# Altium schematic sheet ICAN-7006-MCU.SchDoc
size A3; PageSetup: Record=PageOptions|CenterHorizontal=True|CenterVertical=True|PrintScale=1.04|XCorrection=1.00|YCorrection=1.00|PrintKind=0|BorderSize=5000000|LeftOffset=0|BottomOffset=0|Orientation=2|PaperLength=1000|PaperWidth=1000|Scale=100|PaperSource=7|PrintQuality=-4|MediaType=1|DitherType=10|PaperKind=A3|PrintScaleMode=1
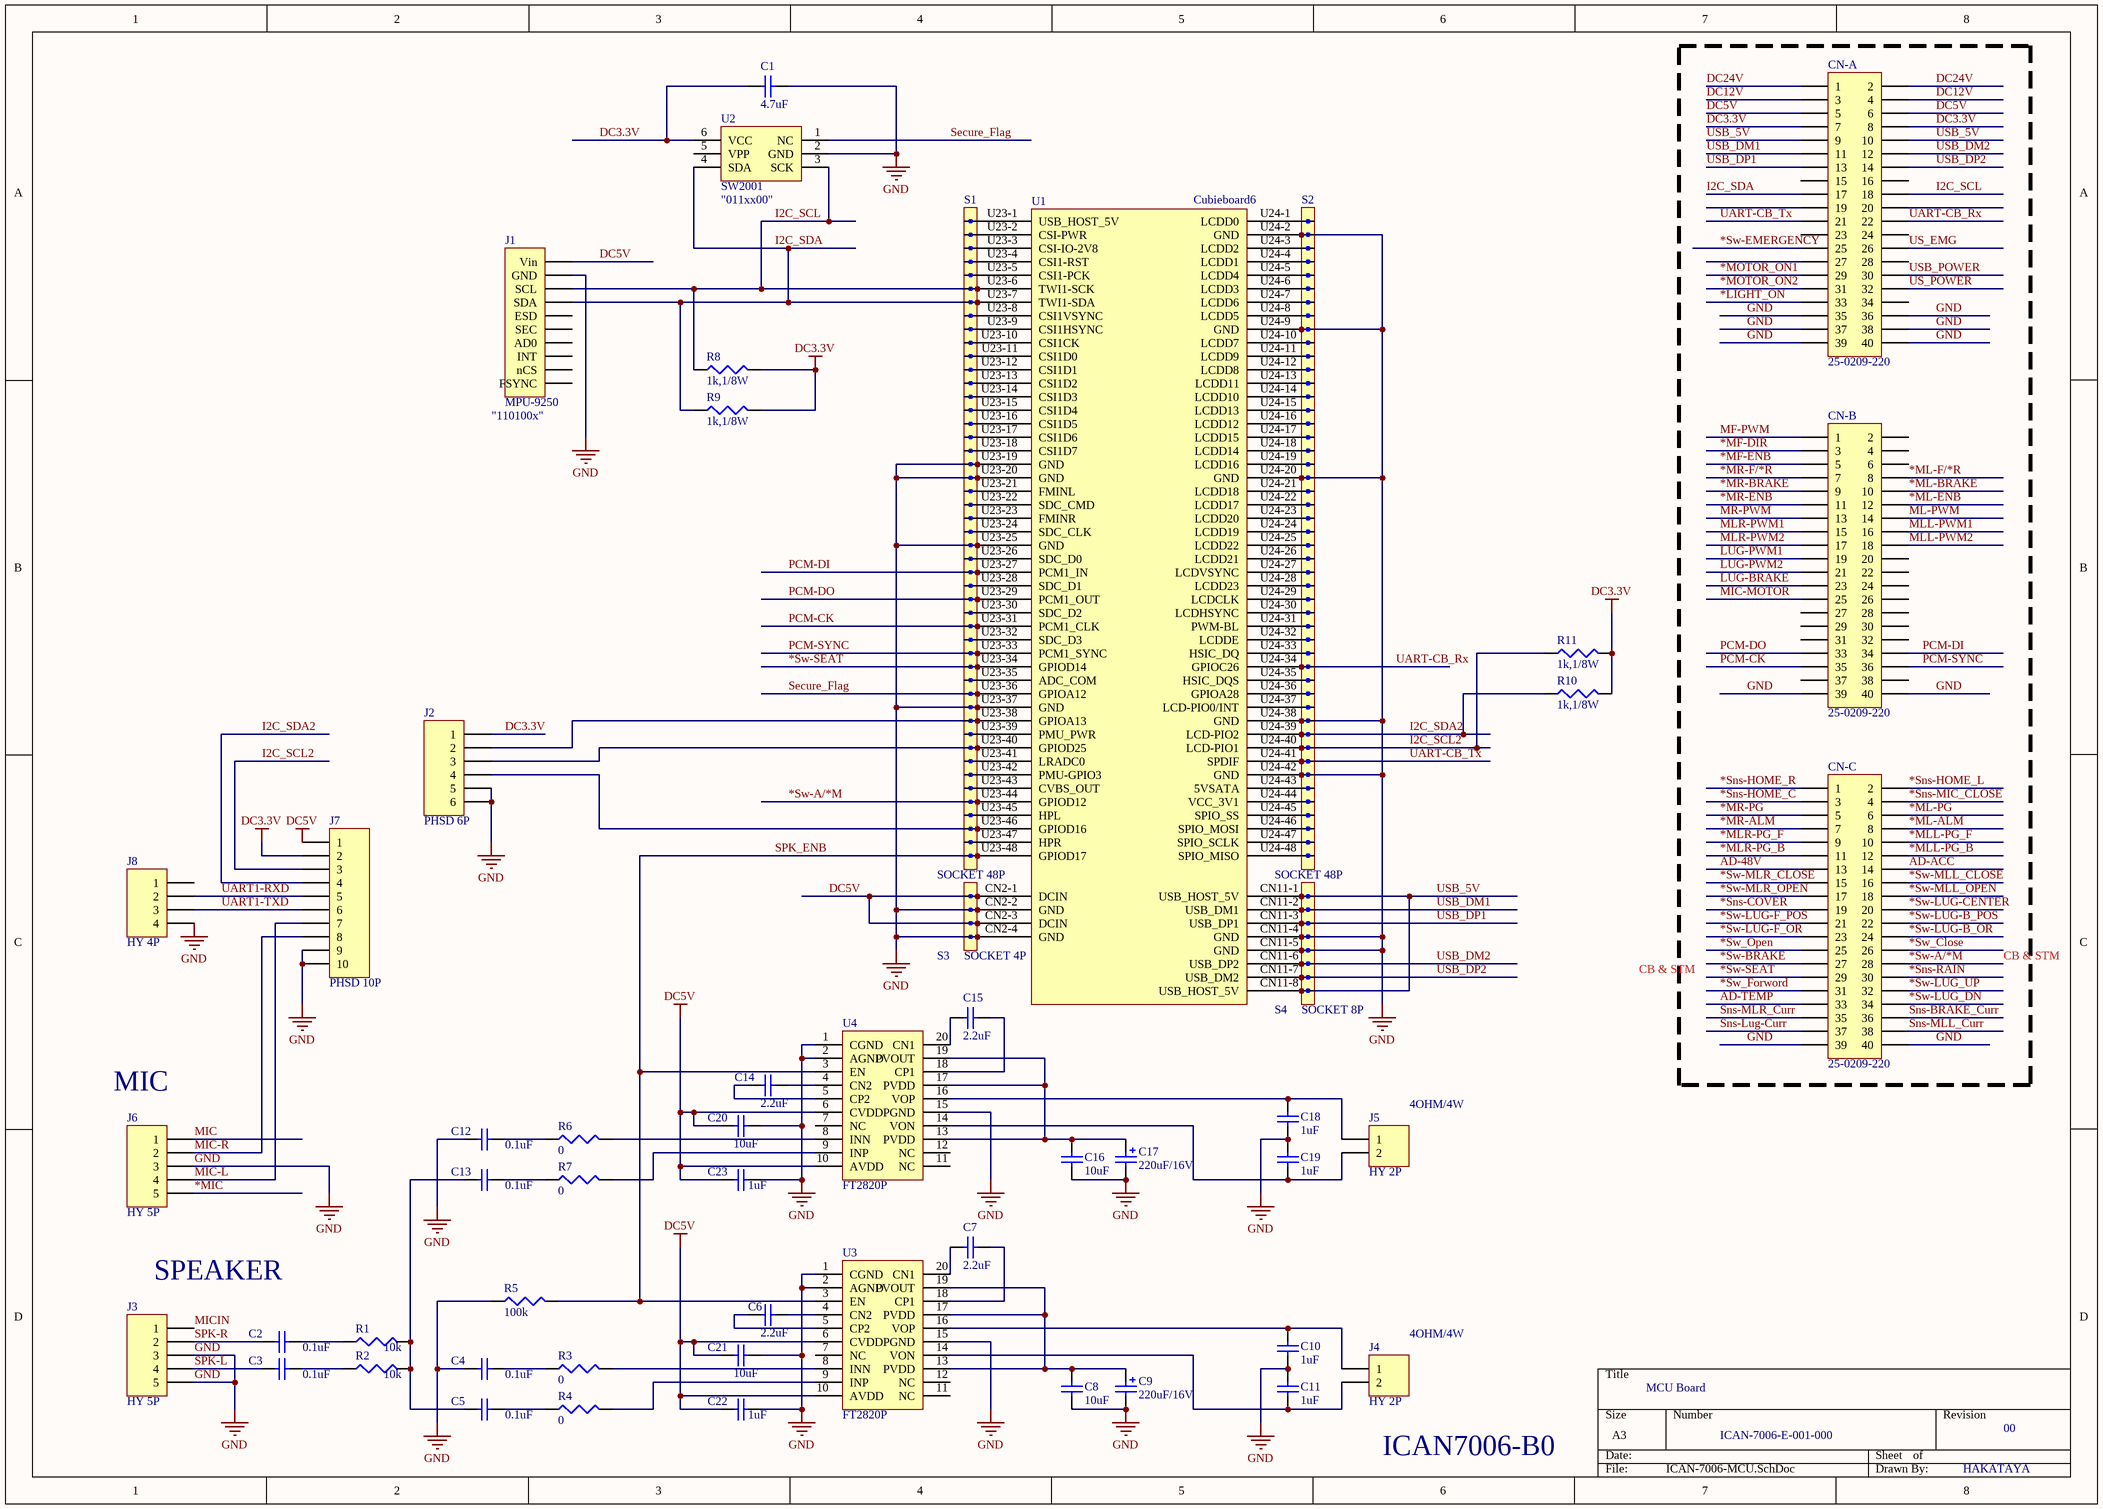
[diagram p0: ICAN-7006-MCU.SchDoc]

## Parts
C1  4.7uF  [[0805]2012]
C2  0.1uF  [[0805]2012]
C3  0.1uF  [[0805]2012]
C4  0.1uF  [[0805]2012]
C5  0.1uF  [[0805]2012]
C6  2.2uF  [[0805]2012]
C7  2.2uF  [[0805]2012]
C8  10uF  [[0805]2012]
C9  220uF/16V  [CAPA WXA PITCH 3.5mm]
C10  1uF  [[0805]2012]
C11  1uF  [[0805]2012]
C12  0.1uF  [[0805]2012]
C13  0.1uF  [[0805]2012]
C14  2.2uF  [[0805]2012]
C15  2.2uF  [[0805]2012]
C16  10uF  [[0805]2012]
C17  220uF/16V  [CAPA WXA PITCH 3.5mm]
C18  1uF  [[0805]2012]
C19  1uF  [[0805]2012]
C20  10uF  [[0805]2012]
C21  10uF  [[0805]2012]
C22  1uF  [[0805]2012]
C23  1uF  [[0805]2012]
CN-A  25-0209-220  [HDR2X20]
CN-B  25-0209-220  [HDR2X20]
CN-C  25-0209-220  [HDR2X20]
J1  MPU-9250  [HDR1X10]
J2  PHSD 6P  [PHSD WV03x2]
J3  HY 5P  [HY-5A]
J4  HY 2P  [HY-2A]
J5  HY 2P  [HY-2A]
J6  HY 5P  [HY-5A]
J7  PHSD 10P  [PHSD WV05x2]
J8  HY 4P  [HY-4AW]
R1  10k  [[0805]2012]
R2  10k  [[0805]2012]
R3  0  [[0805]2012]
R4  0  [[0805]2012]
R5  100k  [[0805]2012]
R6  0  [[0805]2012]
R7  0  [[0805]2012]
R8  1k,1/8W  [[0805]2012]
R9  1k,1/8W  [[0805]2012]
R10  1k,1/8W  [[0805]2012]
R11  1k,1/8W  [[0805]2012]
S1  SOCKET 48P  [SOCKET 2.0mm X 24 DOUBLE]
S2  SOCKET 48P  [SOCKET 2.0mm X 24 DOUBLE]
S3  SOCKET 4P  [SOCKET 2.0mm X 2 DOUBLE]
S4  SOCKET 8P  [SOCKET 2.0mm X 4 DOUBLE-2]
U1  Cubieboard6  [Cubieboard6]
U2  SW2001  [SOP]
U3  FT2820P  [SSOP-20]
U4  FT2820P  [SSOP-20]

## Blocks framed on the sheet
CB & STM: CN-A CN-B CN-C

## Nets
DC3.3V: C1.1 CN-A.7 CN-A.8 J2.1 J7.2 R8.2 R9.2 R10.2 R11.2 U2.6(VCC)
DC5V: C20.1 C21.1 C22.1 C23.1 CN-A.5 CN-A.6 J1.1(Vin) J7.1 S3.1 S3.3 U1.CN2-1(DCIN) U1.CN2-3(DCIN) U3.6(CVDD) U3.10(AVDD) U4.6(CVDD) U4.10(AVDD)
GND: C1.2 C4.1 C8.1 C9.2 C10.1 C11.2 C12.1 C16.1 C17.2 C18.1 C19.2 C20.2 C21.2 C22.2 C23.2 CN-A.35 CN-A.36 CN-A.37 CN-A.38 CN-A.39 CN-A.40 CN-B.39 CN-B.40 CN-C.39 CN-C.40 J1.2(GND) J2.5 J2.6 J3.3 J3.5 J6.3 J7.9 J7.10 J8.4 R5.2 S1.19 S1.20 S1.25 S1.37 S2.2 S2.9 S2.20 S2.38 S2.42 S3.2 S3.4 S4.4 S4.5 U1.CN2-2(GND) U1.CN2-4(GND) U1.CN11-4(GND) U1.CN11-5(GND) U1.U23-19(GND) U1.U23-20(GND) U1.U23-25(GND) U1.U23-37(GND) U1.U24-2(GND) U1.U24-9(GND) U1.U24-20(GND) U1.U24-38(GND) U1.U24-42(GND) U2.2(GND) U3.1(CGND) U3.2(AGND) U3.15(PGND) U4.1(CGND) U4.2(AGND) U4.15(PGND)
*LIGHT_ON: CN-A.33
*MF-DIR: CN-B.3
*MF-ENB: CN-B.5
*MIC: J6.5
*ML-ALM: CN-C.8
*ML-BRAKE: CN-B.10
*ML-ENB: CN-B.12
*ML-F/*R: CN-B.8
*ML-PG: CN-C.6
*MLL-PG_B: CN-C.12
*MLL-PG_F: CN-C.10
*MLR-PG_B: CN-C.11
*MLR-PG_F: CN-C.9
*MOTOR_ON1: CN-A.29
*MOTOR_ON2: CN-A.31
*MR-ALM: CN-C.7
*MR-BRAKE: CN-B.9
*MR-ENB: CN-B.11
*MR-F/*R: CN-B.7
*MR-PG: CN-C.5
*Sns-COVER: CN-C.19
*Sns-HOME_C: CN-C.3
*Sns-HOME_L: CN-C.2
*Sns-HOME_R: CN-C.1
*Sns-MIC_CLOSE: CN-C.4
*Sns-RAIN: CN-C.30
*Sw-A/*M: CN-C.28 S1.44 U1.U23-44(GPIOD12)
*Sw-BRAKE: CN-C.27
*Sw-EMERGENCY: CN-A.25
*Sw-LUG-B_OR: CN-C.24
*Sw-LUG-B_POS: CN-C.22
*Sw-LUG-CENTER: CN-C.20
*Sw-LUG-F_OR: CN-C.23
*Sw-LUG-F_POS: CN-C.21
*Sw-LUG_DN: CN-C.34
*Sw-LUG_UP: CN-C.32
*Sw-MLL_CLOSE: CN-C.16
*Sw-MLL_OPEN: CN-C.18
*Sw-MLR_CLOSE: CN-C.15
*Sw-MLR_OPEN: CN-C.17
*Sw-SEAT: CN-C.29 S1.34 U1.U23-34(GPIOD14)
*Sw_Close: CN-C.26
*Sw_Forword: CN-C.31
*Sw_Open: CN-C.25
AD-48V: CN-C.13
AD-ACC: CN-C.14
AD-TEMP: CN-C.33
DC12V: CN-A.3 CN-A.4
DC24V: CN-A.1 CN-A.2
I2C_SCL: CN-A.18 J1.3(SCL) R8.1 S1.6 U1.U23-6(TWI1-SCK) U2.3(SCK)
I2C_SCL2: J7.3 R11.1 S2.40 U1.U24-40(LCD-PIO1)
I2C_SDA: CN-A.17 J1.4(SDA) R9.1 S1.7 U1.U23-7(TWI1-SDA) U2.4(SDA)
I2C_SDA2: J7.4 R10.1 S2.39 U1.U24-39(LCD-PIO2)
LUG-BRAKE: CN-B.23
LUG-PWM1: CN-B.19
LUG-PWM2: CN-B.21
MF-PWM: CN-B.1
MIC: J6.1
MIC-L: J6.4 J7.7
MIC-MOTOR: CN-B.25
MIC-R: J6.2 J7.8
MICIN: J3.1
ML-PWM: CN-B.14
MLL-PWM1: CN-B.16
MLL-PWM2: CN-B.18
MLR-PWM1: CN-B.15
MLR-PWM2: CN-B.17
MR-PWM: CN-B.13
PCM-CK: CN-B.35 S1.31 U1.U23-31(PCM1_CLK)
PCM-DI: CN-B.34 S1.27 U1.U23-27(PCM1_IN)
PCM-DO: CN-B.33 S1.29 U1.U23-29(PCM1_OUT)
PCM-SYNC: CN-B.36 S1.33 U1.U23-33(PCM1_SYNC)
Secure_Flag: S1.36 U1.U23-36(GPIOA12) U2.1(NC)
Sns-BRAKE_Curr: CN-C.36
Sns-Lug-Curr: CN-C.37
Sns-MLL_Curr: CN-C.38
Sns-MLR_Curr: CN-C.35
SPK-L: C3.1 J3.4
SPK-R: C2.1 J3.2
SPK_ENB: R5.1 S1.48 U1.U23-48(GPIOD17) U3.3(EN) U4.3(EN)
UART1-RXD: J7.5 J8.2
UART1-TXD: J7.6 J8.3
UART-CB_Rx: CN-A.22 S2.34 U1.U24-34(GPIOC26)
UART-CB_Tx: CN-A.21 S2.41 U1.U24-41(SPDIF)
US_EMG: CN-A.26
US_POWER: CN-A.32
USB_5V: CN-A.9 CN-A.10 S4.1 S4.8 U1.CN11-1(USB_HOST_5V) U1.CN11-8(USB_HOST_5V)
USB_DM1: CN-A.11 S4.2 U1.CN11-2(USB_DM1)
USB_DM2: CN-A.12 S4.6 U1.CN11-6(USB_DP2)
USB_DP1: CN-A.13 S4.3 U1.CN11-3(USB_DP1)
USB_DP2: CN-A.14 S4.7 U1.CN11-7(USB_DM2)
USB_POWER: CN-A.30
NetC2_2: C2.2 R1.1
NetC3_2: C3.2 R2.1
NetC4_2: C4.2 R3.1
NetC5_1: C5.1 C13.1 R1.2 R2.2
NetC5_2: C5.2 R4.1
NetC6_1: C6.1 U3.5(CP2)
NetC6_2: C6.2 U3.4(CN2)
NetC7_1: C7.1 U3.20(CN1)
NetC7_2: C7.2 U3.18(CP1)
NetC8_2: C8.2 C9.1 U3.13(PVDD) U3.17(PVDD) U3.19(PVOUT)
NetC10_2: C10.2 J4.1 U3.16(VOP)
NetC11_1: C11.1 J4.2 U3.14(VON)
NetC12_2: C12.2 R6.1
NetC13_2: C13.2 R7.1
NetC14_1: C14.1 U4.5(CP2)
NetC14_2: C14.2 U4.4(CN2)
NetC15_1: C15.1 U4.20(CN1)
NetC15_2: C15.2 U4.18(CP1)
NetC16_2: C16.2 C17.1 U4.13(PVDD) U4.17(PVDD) U4.19(PVOUT)
NetC18_2: C18.2 J5.1 U4.16(VOP)
NetC19_1: C19.1 J5.2 U4.14(VON)
NetJ2_2: J2.2 S1.38 U1.U23-38(GPIOA13)
NetJ2_3: J2.3 S1.40 U1.U23-40(GPIOD25)
NetJ2_4: J2.4 S1.46 U1.U23-46(GPIOD16)
NetR3_2: R3.2 U3.8(INN)
NetR4_2: R4.2 U3.9(INP)
NetR6_2: R6.2 U4.8(INN)
NetR7_2: R7.2 U4.9(INP)
NetS1_1: S1.1 U1.U23-1(USB_HOST_5V)
NetS1_2: S1.2 U1.U23-2(CSI-PWR)
NetS1_3: S1.3 U1.U23-3(CSI-IO-2V8)
NetS1_4: S1.4 U1.U23-4(CSI1-RST)
NetS1_5: S1.5 U1.U23-5(CSI1-PCK)
NetS1_8: S1.8 U1.U23-8(CSI1VSYNC)
NetS1_9: S1.9 U1.U23-9(CSI1HSYNC)
NetS1_10: S1.10 U1.U23-10(CSI1CK)
NetS1_11: S1.11 U1.U23-11(CSI1D0)
NetS1_12: S1.12 U1.U23-12(CSI1D1)
NetS1_13: S1.13 U1.U23-13(CSI1D2)
NetS1_14: S1.14 U1.U23-14(CSI1D3)
NetS1_15: S1.15 U1.U23-15(CSI1D4)
NetS1_16: S1.16 U1.U23-16(CSI1D5)
NetS1_17: S1.17 U1.U23-17(CSI1D6)
NetS1_18: S1.18 U1.U23-18(CSI1D7)
NetS1_21: S1.21 U1.U23-21(FMINL)
NetS1_22: S1.22 U1.U23-22(SDC_CMD)
NetS1_23: S1.23 U1.U23-23(FMINR)
NetS1_24: S1.24 U1.U23-24(SDC_CLK)
NetS1_26: S1.26 U1.U23-26(SDC_D0)
NetS1_28: S1.28 U1.U23-28(SDC_D1)
NetS1_30: S1.30 U1.U23-30(SDC_D2)
NetS1_32: S1.32 U1.U23-32(SDC_D3)
NetS1_35: S1.35 U1.U23-35(ADC_COM)
NetS1_39: S1.39 U1.U23-39(PMU_PWR)
NetS1_41: S1.41 U1.U23-41(LRADC0)
NetS1_42: S1.42 U1.U23-42(PMU-GPIO3)
NetS1_43: S1.43 U1.U23-43(CVBS_OUT)
NetS1_45: S1.45 U1.U23-45(HPL)
NetS1_47: S1.47 U1.U23-47(HPR)
NetS2_1: S2.1 U1.U24-1(LCDD0)
NetS2_3: S2.3 U1.U24-3(LCDD2)
NetS2_4: S2.4 U1.U24-4(LCDD1)
NetS2_5: S2.5 U1.U24-5(LCDD4)
NetS2_6: S2.6 U1.U24-6(LCDD3)
NetS2_7: S2.7 U1.U24-7(LCDD6)
NetS2_8: S2.8 U1.U24-8(LCDD5)
NetS2_10: S2.10 U1.U24-10(LCDD7)
NetS2_11: S2.11 U1.U24-11(LCDD9)
NetS2_12: S2.12 U1.U24-12(LCDD8)
NetS2_13: S2.13 U1.U24-13(LCDD11)
NetS2_14: S2.14 U1.U24-14(LCDD10)
NetS2_15: S2.15 U1.U24-15(LCDD13)
NetS2_16: S2.16 U1.U24-16(LCDD12)
NetS2_17: S2.17 U1.U24-17(LCDD15)
NetS2_18: S2.18 U1.U24-18(LCDD14)
NetS2_19: S2.19 U1.U24-19(LCDD16)
NetS2_21: S2.21 U1.U24-21(LCDD18)
NetS2_22: S2.22 U1.U24-22(LCDD17)
NetS2_23: S2.23 U1.U24-23(LCDD20)
NetS2_24: S2.24 U1.U24-24(LCDD19)
NetS2_25: S2.25 U1.U24-25(LCDD22)
NetS2_26: S2.26 U1.U24-26(LCDD21)
NetS2_27: S2.27 U1.U24-27(LCDVSYNC)
NetS2_28: S2.28 U1.U24-28(LCDD23)
NetS2_29: S2.29 U1.U24-29(LCDCLK)
NetS2_30: S2.30 U1.U24-30(LCDHSYNC)
NetS2_31: S2.31 U1.U24-31(PWM-BL)
NetS2_32: S2.32 U1.U24-32(LCDDE)
NetS2_33: S2.33 U1.U24-33(HSIC_DQ)
NetS2_35: S2.35 U1.U24-35(HSIC_DQS)
NetS2_36: S2.36 U1.U24-36(GPIOA28)
NetS2_37: S2.37 U1.U24-37(LCD-PIO0/INT)
NetS2_43: S2.43 U1.U24-43(5VSATA)
NetS2_44: S2.44 U1.U24-44(VCC_3V1)
NetS2_45: S2.45 U1.U24-45(SPIO_SS)
NetS2_46: S2.46 U1.U24-46(SPIO_MOSI)
NetS2_47: S2.47 U1.U24-47(SPIO_SCLK)
NetS2_48: S2.48 U1.U24-48(SPIO_MISO)

Not connected (* = marked no-connect by the designer): CN-A 15 16 19 20 23 24 27 28 34; CN-B 2 4 6 20 22 24 26 27 28 29 30 31 32 37 38; J1 5(ESD) 6(SEC) 7(AD0) 8(INT) 9(nCS) 10(FSYNC); J8 1; U2 5(VPP); U3 7(NC) 11(NC) 12(NC); U4 7(NC) 11(NC) 12(NC)

## Notes on the sheet
- (near U2) "011xx00"
- (near J1) "110100x"
- CB & STM
- (near J6) MIC
- (near J5) 4OHM/4W
- SPEAKER
- (near J4) 4OHM/4W
- MCU Board
- (near J4) ICAN7006-B0
- ICAN-7006-E-001-000
- 00
- HAKATAYA

## Library data of the parts
C1 = Cap: Capacitor; Published: 8-Jun-2000; LatestRevisionDate: 17-Jul-2002; LatestRevisionNote: Re-released for DXP Platform.; PackageReference: RAD-0.3; Publisher: Altium Limited; Value: 4.7uF
C2-C8 C10-C16 C18-C23 = Cap Semi: Capacitor; Published: 8-Jun-2000; LatestRevisionDate: 17-Jul-2002; LatestRevisionNote: Re-released for DXP Platform.; PackageReference: C1206; Publisher: Altium Limited
  C2-C5 C12 C13: Value: 0.1uF
  C6 C7 C14 C15: Value: 2.2uF
  C8 C16 C20 C21: Value: 10uF
  C10 C11 C18 C19 C22 C23: Value: 1uF
C9 C17 = Cap Pol2: Polarized Capacitor (Axial); Published: 8-Jun-2000; LatestRevisionDate: 17-Jul-2002; LatestRevisionNote: Re-released for DXP Platform.; PackageReference: POLAR0.8; Publisher: Altium Limited; Value: 220uF/16V; Supplier Part Number: WXA 330uF/25V
CN-A CN-B CN-C = Header 20X2: Header, 20-Pin, Dual row; LatestRevisionDate: 17-Jul-2002; LatestRevisionNote: Re-released for DXP Platform.; Publisher: Altium Limited; Supplier: Astron Corporation.; URL: http://www.astron.com.tw/product.php?idt=1&pid=68&pno=212; Supplier Part Number: 25-0209-220
J1 = Header 10: GYRO; LatestRevisionDate: 17-Jul-2002; LatestRevisionNote: Re-released for DXP Platform.; Publisher: Altium Limited; Supplier Part Number: MPU-9250; Value: MPU-9250
J2 = Header 6: Header, 6-Pin; Value: A2006-WV03X2; LatestRevisionDate: 17-Jul-2002; LatestRevisionNote: Re-released for DXP Platform.; Publisher: Altium Limited; Supplier Part Number: A2006-WV03X2; Supplier: YOLINK
J3 J6 = Header 5: Header, 5-Pin; LatestRevisionDate: 17-Jul-2002; LatestRevisionNote: Re-released for DXP Platform.; Publisher: Altium Limited; Supplier Part Number: A2006-05A; Supplier: YOLINK
J4 J5 = Header 2: Header, 2-Pin; LatestRevisionDate: 17-Jul-2002; LatestRevisionNote: Re-released for DXP Platform.; Publisher: Altium Limited; Supplier Part Number: A2006-02A; Supplier: YOLINK
J7 = Header 10: Header, 10-Pin; LatestRevisionDate: 17-Jul-2002; LatestRevisionNote: Re-released for DXP Platform.; Publisher: Altium Limited; Supplier Part Number: A2006-WV05X2; Supplier: YOLINK
J8 = Header 4: Header, 4-Pin; LatestRevisionDate: 17-Jul-2002; LatestRevisionNote: Re-released for DXP Platform.; Publisher: Altium Limited; Supplier Part Number: A2006-04AW; Supplier: YOLINK
R1-R11 = Res3: Resistor; Published: 8-Jun-2000; LatestRevisionDate: 04-Mar-2005; LatestRevisionNote: PCB Footprint replaced.; PackageReference: J1-0603; Publisher: Altium Limited
  R1 R2: Value: 10k
  R3 R4 R6 R7: Value: 0; Supplier Part Number: MCR10
  R5: Value: 100k
  R8-R11: Value: 1k,1/8W; Supplier Part Number: MCR10
S1 S2 = SOCKET 48P: SOCKET; URL: https://item.taobao.com/item.htm?id=542917893128&ali_trackid=2:mm_121791806_21994248_75072884:1521806862_213_381946262&spm=a231o.7712113%2Fe.1004.1271&pvid=200_11.228.16.128_345826_1521806551379
S3 = SOCKET 4P: SOCKET; URL: https://item.taobao.com/item.htm?id=542917893128&ali_trackid=2:mm_121791806_21994248_75072884:1521806862_213_381946262&spm=a231o.7712113%2Fe.1004.1271&pvid=200_11.228.16.128_345826_1521806551379
S4 = SOCKET 8P: SOCKET; URL: https://item.taobao.com/item.htm?id=542917893128&ali_trackid=2:mm_121791806_21994248_75072884:1521806862_213_381946262&spm=a231o.7712113%2Fe.1004.1271&pvid=200_11.228.16.128_345826_1521806551379
U1 = Cubieboard6: MCU; Supplier Part Number: cubieboard6; Supplier: cubietech; URL: https://item.taobao.com/item.htm?spm=a1z10.1-c.w4004-1395330847.14.69837dd8Pq6CDZ&id=548583853367
U2 = IC6-WIDE: Secure IC; URL: www.ismartware.com.cn; Supplier Part Number: SW2001; Supplier: ismartware
U3 U4 = IC20: Amplifier; Supplier Part Number: FT2820P; Supplier: fangtek